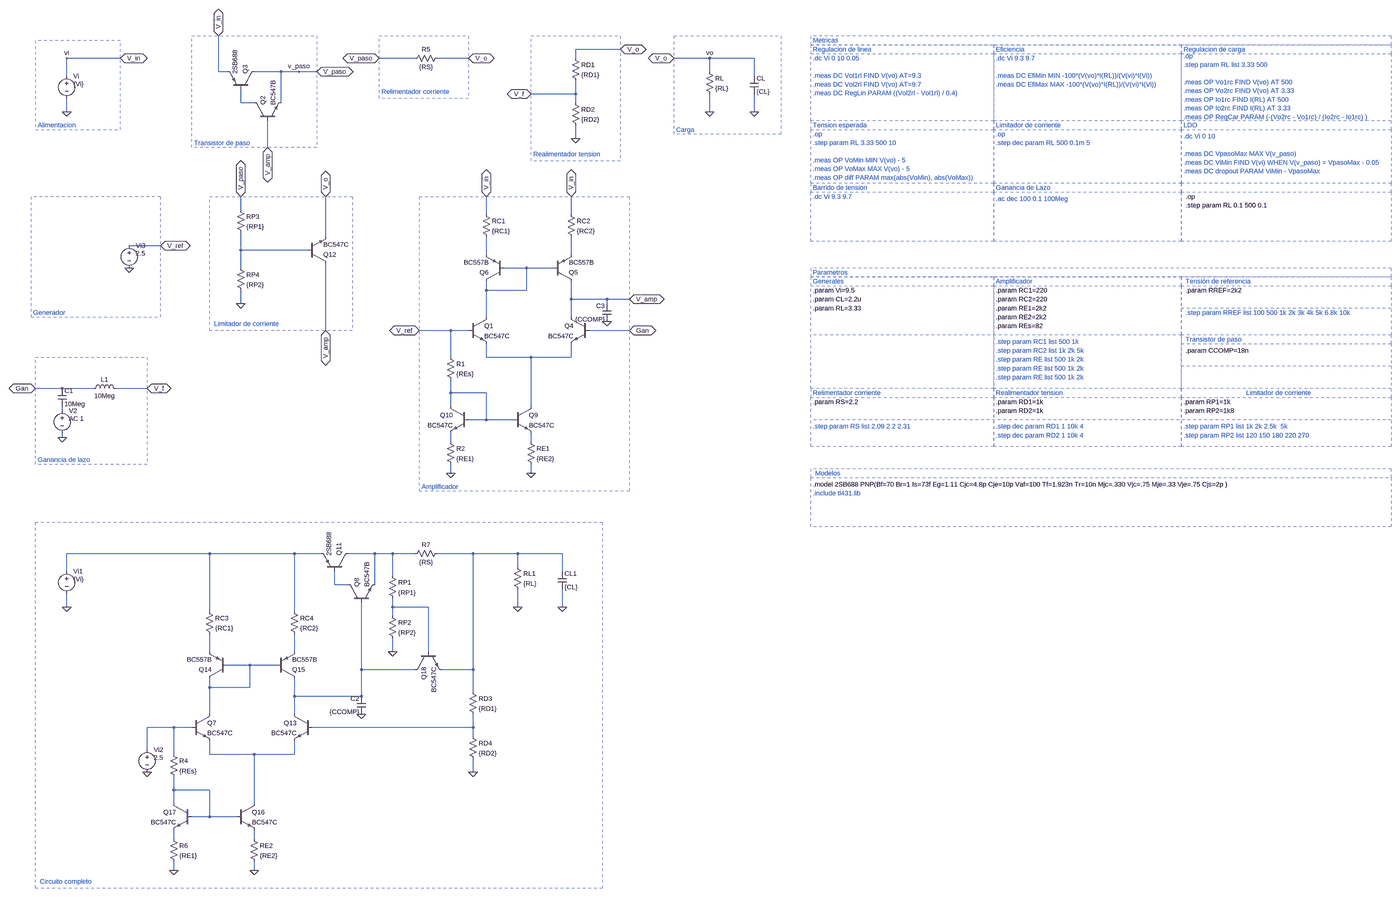
[diagram p0: schematic Etapa lineal.asc, whole sheet]
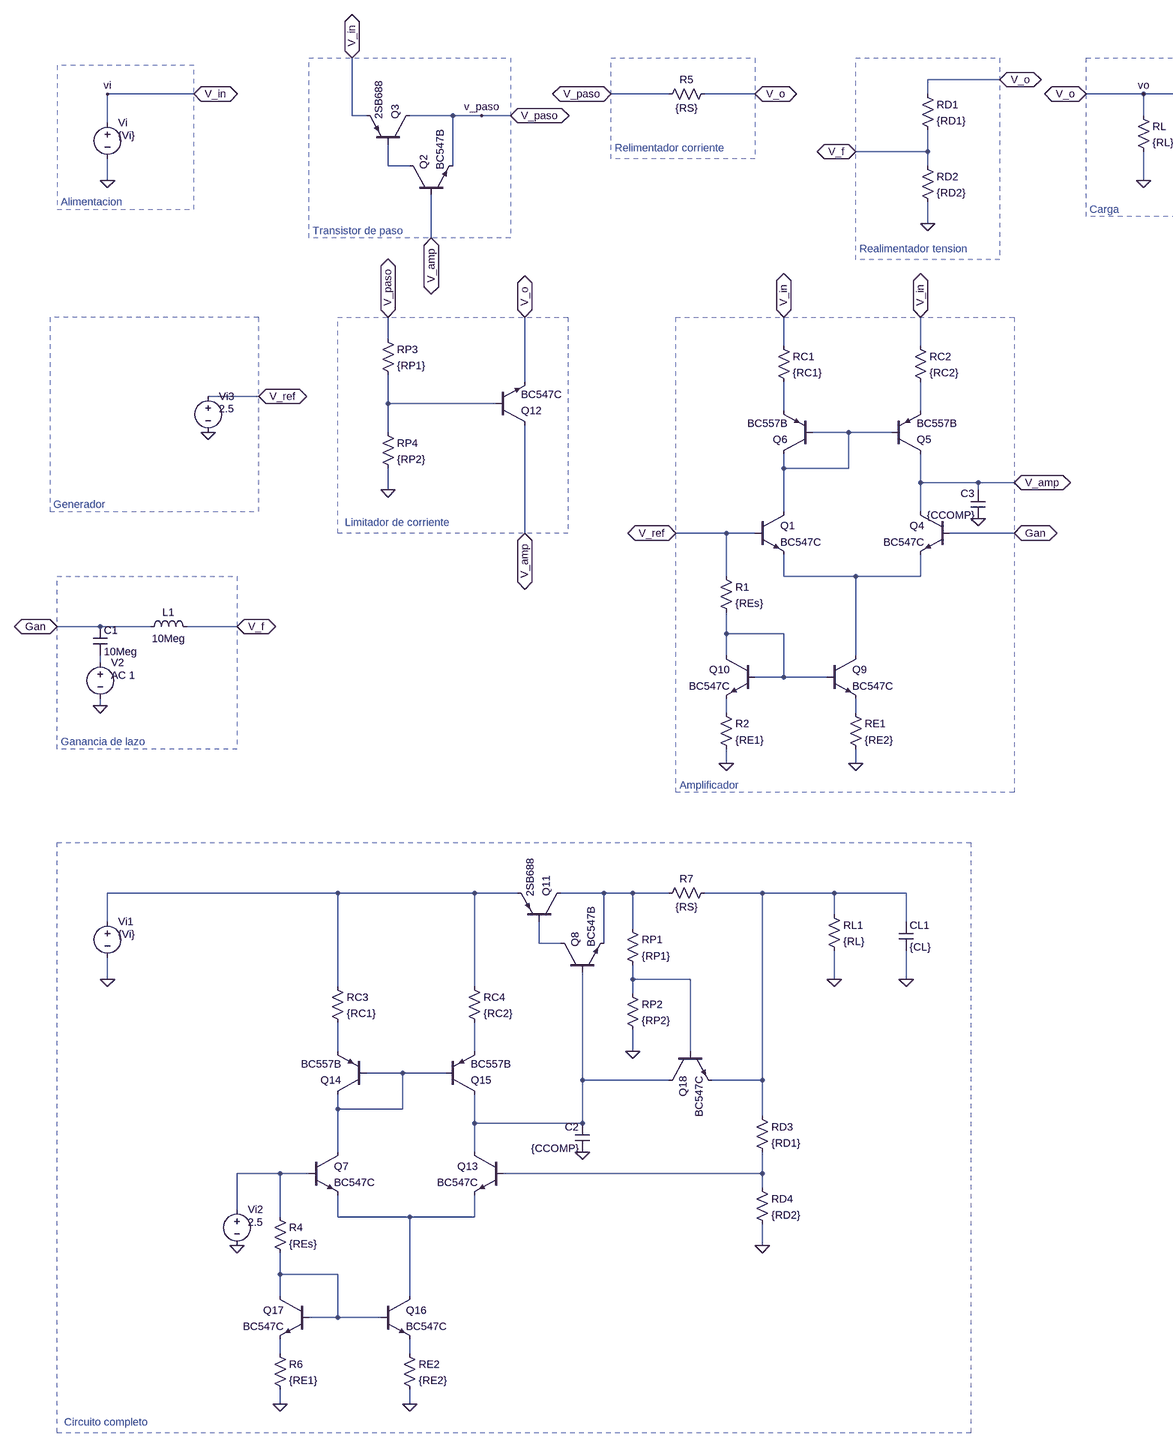
[diagram p1: schematic Etapa lineal.asc, part, row 1 of 1, column 1 of 2]
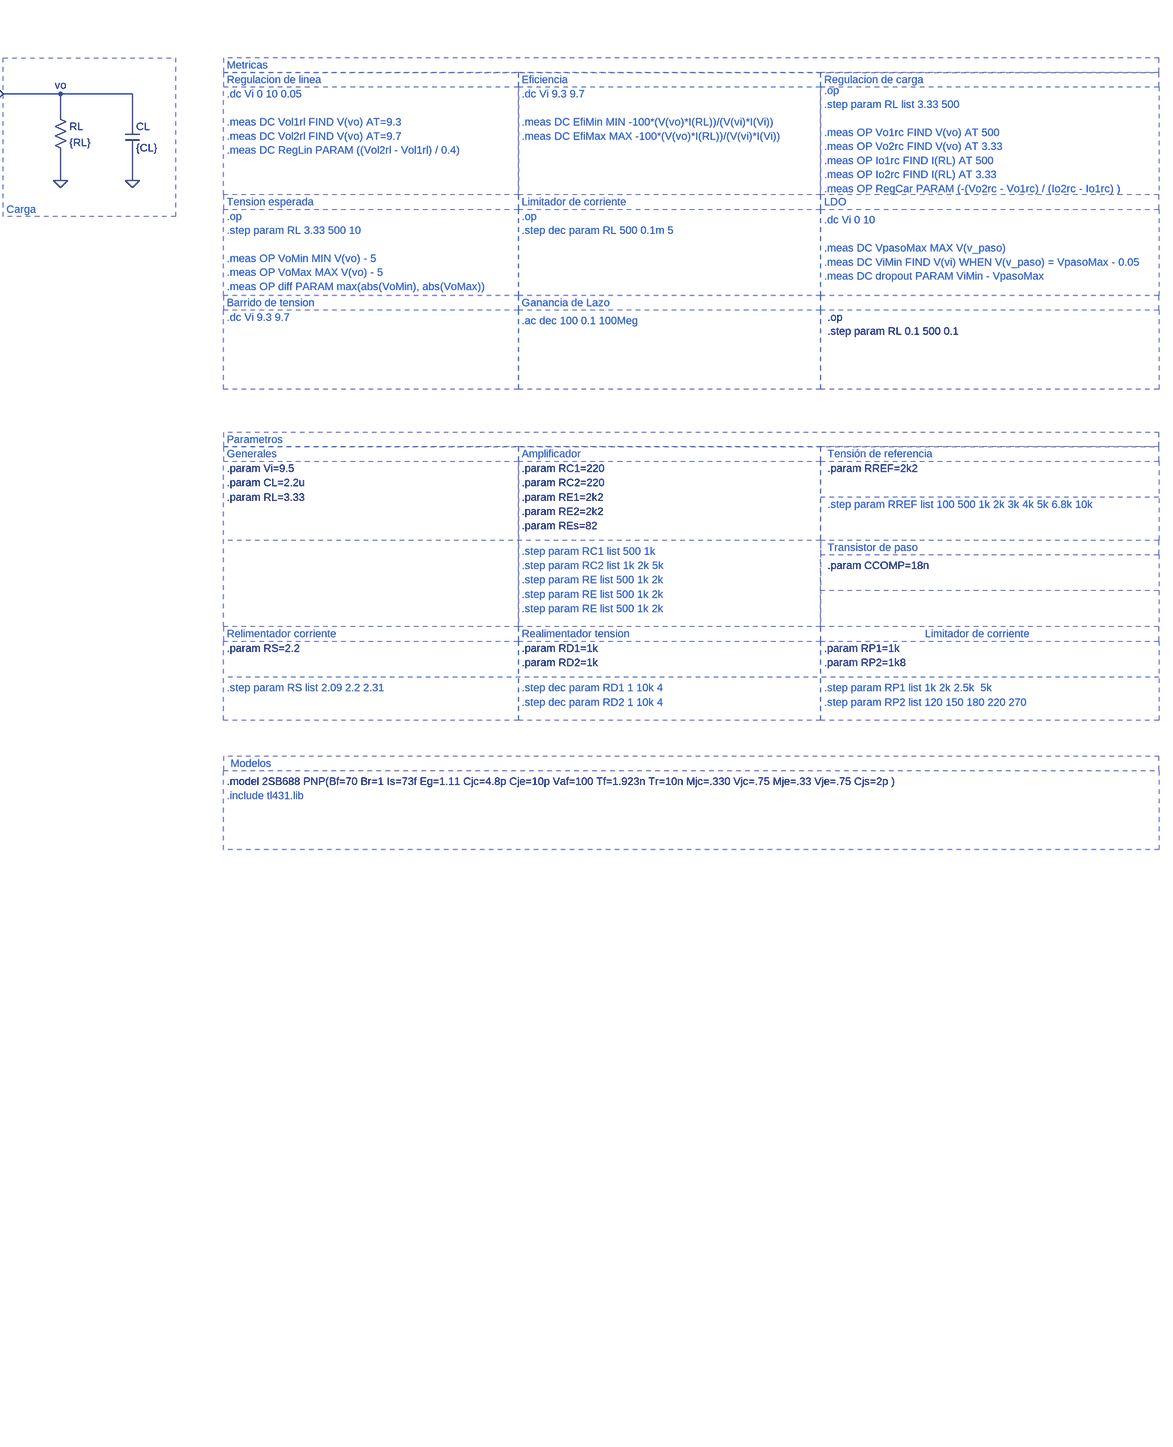
[diagram p2: schematic Etapa lineal.asc, part, row 1 of 1, column 2 of 2]
Etapa lineal.asc, the LTspice schematic file:
Version 4.1
SHEET 1 8164 4196
WIRE 1360 -592 1200 -592
WIRE -432 -560 -624 -560
WIRE 624 -560 496 -560
WIRE 816 -560 704 -560
WIRE 1200 -560 1200 -592
WIRE 1680 -560 1552 -560
WIRE 1840 -560 1680 -560
WIRE -80 -512 -80 -640
WIRE -48 -512 -80 -512
WIRE 144 -512 48 -512
WIRE 208 -512 144 -512
WIRE 272 -512 208 -512
WIRE 1680 -512 1680 -560
WIRE -624 -496 -624 -560
WIRE 1840 -496 1840 -560
WIRE 1200 -432 1200 -480
WIRE 1200 -432 1040 -432
WIRE 0 -400 0 -448
WIRE 48 -400 0 -400
WIRE 144 -400 144 -512
WIRE 1200 -400 1200 -432
WIRE -624 -368 -624 -416
WIRE 1680 -368 1680 -432
WIRE 1840 -368 1840 -432
WIRE 1200 -272 1200 -320
WIRE 96 -240 96 -336
WIRE 0 -16 0 -64
WIRE 880 0 880 -64
WIRE 1184 0 1184 -64
WIRE 304 80 304 -64
WIRE -288 112 -400 112
WIRE 0 128 0 64
WIRE 240 128 0 128
WIRE 880 144 880 80
WIRE 1184 144 1184 80
WIRE 0 192 0 128
WIRE 1024 192 944 192
WIRE 1120 192 1024 192
WIRE 880 272 880 240
WIRE 1024 272 1024 192
WIRE 1024 272 880 272
WIRE 1184 304 1184 240
WIRE 1312 304 1184 304
WIRE 1392 304 1312 304
WIRE 0 320 0 272
WIRE 1312 320 1312 304
WIRE 880 368 880 272
WIRE 1184 368 1184 304
WIRE 304 416 304 176
WIRE 752 416 640 416
WIRE 816 416 752 416
WIRE 1392 416 1248 416
WIRE 752 512 752 416
WIRE 880 512 880 464
WIRE 1040 512 880 512
WIRE 1184 512 1184 464
WIRE 1184 512 1040 512
WIRE -640 624 -736 624
WIRE -528 624 -640 624
WIRE -336 624 -448 624
WIRE 752 640 752 592
WIRE 880 640 752 640
WIRE 752 688 752 640
WIRE 1040 688 1040 512
WIRE -640 704 -640 688
WIRE 880 736 880 640
WIRE 880 736 816 736
WIRE 976 736 880 736
WIRE -640 800 -640 784
WIRE 752 816 752 784
WIRE 1040 816 1040 784
WIRE 752 928 752 896
WIRE 1040 928 1040 896
WIRE -112 1216 -624 1216
WIRE 192 1216 -112 1216
WIRE 288 1216 192 1216
WIRE 480 1216 384 1216
WIRE 544 1216 480 1216
WIRE 624 1216 544 1216
WIRE 832 1216 704 1216
WIRE 992 1216 832 1216
WIRE 1152 1216 992 1216
WIRE 992 1264 992 1216
WIRE -624 1280 -624 1216
WIRE 1152 1280 1152 1216
WIRE 544 1296 544 1216
WIRE 336 1328 336 1280
WIRE 384 1328 336 1328
WIRE 480 1328 480 1216
WIRE -624 1408 -624 1360
WIRE 544 1408 544 1376
WIRE 672 1408 544 1408
WIRE 992 1408 992 1344
WIRE 1152 1408 1152 1344
WIRE -112 1424 -112 1216
WIRE 192 1424 192 1216
WIRE 544 1440 544 1408
WIRE -112 1568 -112 1504
WIRE 192 1568 192 1504
WIRE 544 1568 544 1520
WIRE 672 1568 672 1408
WIRE 32 1616 -48 1616
WIRE 128 1616 32 1616
WIRE 432 1632 432 1392
WIRE 624 1632 432 1632
WIRE 832 1632 832 1216
WIRE 832 1632 720 1632
WIRE -112 1696 -112 1664
WIRE 32 1696 32 1616
WIRE 32 1696 -112 1696
WIRE 832 1712 832 1632
WIRE 192 1728 192 1664
WIRE 432 1728 432 1632
WIRE 432 1728 192 1728
WIRE -112 1792 -112 1696
WIRE 192 1792 192 1728
WIRE -240 1840 -336 1840
WIRE -176 1840 -240 1840
WIRE 832 1840 832 1792
WIRE 832 1840 256 1840
WIRE 832 1872 832 1840
WIRE -336 1920 -336 1840
WIRE -240 1936 -240 1840
WIRE -112 1936 -112 1888
WIRE 48 1936 -112 1936
WIRE 192 1936 192 1888
WIRE 192 1936 48 1936
WIRE 832 2000 832 1952
WIRE -240 2064 -240 2016
WIRE -112 2064 -240 2064
WIRE -240 2112 -240 2064
WIRE 48 2112 48 1936
WIRE -112 2160 -112 2064
WIRE -112 2160 -176 2160
WIRE -16 2160 -112 2160
WIRE -240 2240 -240 2208
WIRE 48 2240 48 2208
WIRE -240 2352 -240 2320
WIRE 48 2352 48 2320
FLAG -288 112 V_ref
IOPIN -288 112 BiDir
FLAG -624 -368 0
FLAG -432 -560 V_in
IOPIN -432 -560 BiDir
FLAG 880 -64 V_in
IOPIN 880 -64 BiDir
FLAG 1200 -272 0
FLAG 640 416 V_ref
IOPIN 640 416 BiDir
FLAG 1680 -368 0
FLAG 1552 -560 V_o
IOPIN 1552 -560 BiDir
FLAG 1680 -560 vo
FLAG 1392 416 Gan
IOPIN 1392 416 BiDir
FLAG 1360 -592 V_o
IOPIN 1360 -592 BiDir
FLAG 1040 -432 V_f
IOPIN 1040 -432 BiDir
FLAG -624 -560 vi
FLAG -80 -640 V_in
IOPIN -80 -640 BiDir
FLAG 1392 304 V_amp
IOPIN 1392 304 BiDir
FLAG 96 -240 V_amp
IOPIN 96 -240 BiDir
FLAG 1040 928 0
FLAG 1184 -64 V_in
IOPIN 1184 -64 BiDir
FLAG 752 928 0
FLAG 816 -560 V_o
IOPIN 816 -560 BiDir
FLAG 1840 -368 0
FLAG 272 -512 V_paso
IOPIN 272 -512 BiDir
FLAG 496 -560 V_paso
IOPIN 496 -560 BiDir
FLAG 0 320 0
FLAG 304 416 V_amp
IOPIN 304 416 BiDir
FLAG 0 -64 V_paso
IOPIN 0 -64 BiDir
FLAG 304 -64 V_o
IOPIN 304 -64 BiDir
FLAG 208 -512 v_paso
FLAG -640 800 0
FLAG -736 624 Gan
IOPIN -736 624 BiDir
FLAG -336 624 V_f
IOPIN -336 624 BiDir
FLAG -624 1408 0
FLAG 832 2000 0
FLAG 992 1408 0
FLAG 48 2352 0
FLAG -240 2352 0
FLAG 1152 1408 0
FLAG 544 1568 0
FLAG -336 2000 0
FLAG -400 192 0
FLAG 1312 384 0
FLAG 432 1792 0
SYMBOL voltage -624 -512 R0
WINDOW 3 24 44 Left 2
WINDOW 123 24 44 Left 2
WINDOW 39 0 0 Left 0
SYMATTR Value {Vi}
SYMATTR InstName Vi
SYMBOL res 864 -16 R0
SYMATTR InstName RC1
SYMATTR Value {RC1}
SYMBOL res 1184 -576 R0
SYMATTR InstName RD1
SYMATTR Value {RD1}
SYMBOL res 1184 -416 R0
SYMATTR InstName RD2
SYMATTR Value {RD2}
SYMBOL res 1664 -528 R0
SYMATTR InstName RL
SYMATTR Value {RL}
SYMBOL npn 816 368 R0
SYMATTR InstName Q1
SYMATTR Value BC547C
SYMBOL npn 48 -336 R270
SYMATTR InstName Q2
SYMATTR Value BC547B
SYMBOL pnp 48 -448 M270
SYMATTR InstName Q3
SYMATTR Value 2SB688
SYMBOL npn 1248 368 M0
SYMATTR InstName Q4
SYMATTR Value BC547C
SYMBOL res 1024 800 R0
SYMATTR InstName RE1
SYMATTR Value {RE2}
SYMBOL res 1168 -16 R0
SYMATTR InstName RC2
SYMATTR Value {RC2}
SYMBOL pnp 944 240 R180
SYMATTR InstName Q6
SYMATTR Value BC557B
SYMBOL pnp 1120 240 M180
SYMATTR InstName Q5
SYMATTR Value BC557B
SYMBOL npn 976 688 R0
SYMATTR InstName Q9
SYMATTR Value BC547C
SYMBOL npn 816 688 M0
SYMATTR InstName Q10
SYMATTR Value BC547C
SYMBOL res 736 496 R0
SYMATTR InstName R1
SYMATTR Value {REs}
SYMBOL res 736 800 R0
SYMATTR InstName R2
SYMATTR Value {RE1}
SYMBOL res 720 -576 R90
WINDOW 0 0 56 VBottom 2
WINDOW 3 32 56 VTop 2
SYMATTR InstName R5
SYMATTR Value {RS}
SYMBOL cap 1824 -496 R0
SYMATTR InstName CL
SYMATTR Value {CL}
SYMBOL res -16 -32 R0
SYMATTR InstName RP3
SYMATTR Value {RP1}
SYMBOL res -16 176 R0
SYMATTR InstName RP4
SYMATTR Value {RP2}
SYMBOL npn 240 176 M180
SYMATTR InstName Q12
SYMATTR Value BC547C
SYMBOL ind -544 640 R270
WINDOW 0 32 56 VTop 2
WINDOW 3 5 56 VBottom 2
SYMATTR InstName L1
SYMATTR Value 10Meg
SYMBOL cap -656 624 R0
SYMATTR InstName C1
SYMATTR Value 10Meg
SYMBOL voltage -640 688 R0
WINDOW 123 24 44 Left 2
WINDOW 39 0 0 Left 0
SYMATTR Value2 AC 1
SYMATTR InstName V2
SYMATTR Value ""
SYMBOL voltage -624 1264 R0
WINDOW 3 24 44 Left 2
WINDOW 123 24 44 Left 2
WINDOW 39 0 0 Left 0
SYMATTR Value {Vi}
SYMATTR InstName Vi1
SYMBOL res -128 1408 R0
SYMATTR InstName RC3
SYMATTR Value {RC1}
SYMBOL res 816 1696 R0
SYMATTR InstName RD3
SYMATTR Value {RD1}
SYMBOL res 816 1856 R0
SYMATTR InstName RD4
SYMATTR Value {RD2}
SYMBOL res 976 1248 R0
SYMATTR InstName RL1
SYMATTR Value {RL}
SYMBOL npn -176 1792 R0
SYMATTR InstName Q7
SYMATTR Value BC547C
SYMBOL npn 384 1392 R270
SYMATTR InstName Q8
SYMATTR Value BC547B
SYMBOL pnp 384 1280 M270
SYMATTR InstName Q11
SYMATTR Value 2SB688
SYMBOL npn 256 1792 M0
SYMATTR InstName Q13
SYMATTR Value BC547C
SYMBOL res 32 2224 R0
SYMATTR InstName RE2
SYMATTR Value {RE2}
SYMBOL res 176 1408 R0
SYMATTR InstName RC4
SYMATTR Value {RC2}
SYMBOL pnp -48 1664 R180
SYMATTR InstName Q14
SYMATTR Value BC557B
SYMBOL pnp 128 1664 M180
SYMATTR InstName Q15
SYMATTR Value BC557B
SYMBOL npn -16 2112 R0
SYMATTR InstName Q16
SYMATTR Value BC547C
SYMBOL npn -176 2112 M0
SYMATTR InstName Q17
SYMATTR Value BC547C
SYMBOL res -256 1920 R0
SYMATTR InstName R4
SYMATTR Value {REs}
SYMBOL res -256 2224 R0
SYMATTR InstName R6
SYMATTR Value {RE1}
SYMBOL res 720 1200 R90
WINDOW 0 0 56 VBottom 2
WINDOW 3 32 56 VTop 2
SYMATTR InstName R7
SYMATTR Value {RS}
SYMBOL cap 1136 1280 R0
SYMATTR InstName CL1
SYMATTR Value {CL}
SYMBOL res 528 1280 R0
SYMATTR InstName RP1
SYMATTR Value {RP1}
SYMBOL res 528 1424 R0
SYMATTR InstName RP2
SYMATTR Value {RP2}
SYMBOL npn 624 1568 M90
SYMATTR InstName Q18
SYMATTR Value BC547C
SYMBOL cap 1328 320 M0
SYMATTR InstName C3
SYMATTR Value {CCOMP}
SYMBOL cap 448 1728 M0
SYMATTR InstName C2
SYMATTR Value {CCOMP}
SYMBOL voltage -336 1904 R0
WINDOW 3 24 44 Left 2
WINDOW 123 24 44 Left 2
WINDOW 39 0 0 Left 0
SYMATTR Value 2.5
SYMATTR InstName Vi2
SYMBOL voltage -400 96 R0
WINDOW 3 24 44 Left 2
WINDOW 123 24 44 Left 2
WINDOW 39 0 0 Left 0
SYMATTR Value 2.5
SYMATTR InstName Vi3
TEXT 2856 456 Left 2 ;.step param RC1 list 500 1k
TEXT 3528 -592 Left 2 ;Regulacion de carga
TEXT -168 -256 Left 2 ;Transistor de paso
TEXT 1048 -216 Left 2 ;Realimentador tension
TEXT 1560 -304 Left 2 ;Carga
TEXT 648 976 Left 2 ;Amplificador
TEXT -728 -320 Left 2 ;Alimentacion
TEXT -744 352 Left 2 ;Generador
TEXT 2856 -592 Left 2 ;Eficiencia
TEXT 2200 -592 Left 2 ;Regulacion de linea
TEXT 2200 -560 Left 2 ;.dc Vi 0 10 0.05\n \n.meas DC Vol1rl FIND V(vo) AT=9.3\n.meas DC Vol2rl FIND V(vo) AT=9.7\n.meas DC RegLin PARAM ((Vol2rl - Vol1rl) / 0.4)
TEXT 3528 -568 Left 2 ;.op\n.step param RL list 3.33 500\n \n.meas OP Vo1rc FIND V(vo) AT 500\n.meas OP Vo2rc FIND V(vo) AT 3.33\n.meas OP Io1rc FIND I(RL) AT 500\n.meas OP Io2rc FIND I(RL) AT 3.33\n.meas OP RegCar PARAM (-(Vo2rc - Vo1rc) / (Io2rc - Io1rc) )
TEXT 2856 304 Left 2 !.param RC2=220
TEXT 2200 240 Left 2 ;Generales
TEXT 2856 240 Left 2 ;Amplificador
TEXT 2856 -560 Left 2 ;.dc Vi 9.3 9.7\n \n.meas DC EfiMin MIN -100*(V(vo)*I(RL))/(V(vi)*I(Vi))\n.meas DC EfiMax MAX -100*(V(vo)*I(RL))/(V(vi)*I(Vi))
TEXT 2200 272 Left 2 !.param Vi=9.5
TEXT 2856 520 Left 2 ;.step param RE list 500 1k 2k
TEXT 2856 336 Left 2 !.param RE1=2k2
TEXT 2200 968 Left 2 !.model 2SB688 PNP(Bf=70 Br=1 Is=73f Eg=1.11 Cjc=4.8p Cje=10p Vaf=100 Tf=1.923n Tr=10n Mjc=.330 Vjc=.75 Mje=.33 Vje=.75 Cjs=2p )
TEXT 2856 -288 Left 2 ;.op\n.step dec param RL 500 0.1m 5
TEXT 2856 -320 Left 2 ;Limitador de corriente
TEXT 2208 928 Left 2 ;Modelos
TEXT 2856 488 Left 2 ;.step param RC2 list 1k 2k 5k
TEXT 2200 -320 Left 2 ;Tension esperada
TEXT 2200 -288 Left 2 ;.op\n.step param RL 3.33 500 10\n \n.meas OP VoMin MIN V(vo) - 5\n.meas OP VoMax MAX V(vo) - 5\n.meas OP diff PARAM max(abs(VoMin), abs(VoMax))
TEXT 2200 304 Left 2 !.param CL=2.2u
TEXT 2856 672 Left 2 !.param RD1=1k
TEXT 2856 760 Left 2 ;.step dec param RD1 1 10k 4
TEXT 2200 672 Left 2 !.param RS=2.2
TEXT 504 -440 Left 2 ;Relimentador corriente
TEXT 2200 760 Left 2 ;.step param RS list 2.09 2.2 2.31
TEXT -96 392 Left 2 ;Limitador de corriente
TEXT 3528 -320 Left 2 ;LDO
TEXT 3528 -280 Left 2 ;.dc Vi 0 10\n \n.meas DC VpasoMax MAX V(v_paso)\n.meas DC ViMin FIND V(vi) WHEN V(v_paso) = VpasoMax - 0.05\n.meas DC dropout PARAM ViMin - VpasoMax
TEXT 2200 336 Left 2 !.param RL=3.33
TEXT 2200 640 Left 2 ;Relimentador corriente
TEXT 2200 208 Left 2 ;Parametros
TEXT 2200 -624 Left 2 ;Metricas
TEXT 2856 640 Left 2 ;Realimentador tension
TEXT 2856 792 Left 2 ;.step dec param RD2 1 10k 4
TEXT 2200 -96 Left 2 ;Barrido de tension
TEXT 2200 -64 Left 2 ;.dc Vi 9.3 9.7
TEXT 3528 672 Left 2 !.param RP1=1k
TEXT 3528 760 Left 2 ;.step param RP1 list 1k 2k 2.5k  5k
TEXT 3752 640 Left 2 ;Limitador de corriente
TEXT 3528 704 Left 2 !.param RP2=1k8
TEXT 3528 792 Left 2 ;.step param RP2 list 120 150 180 220 270
TEXT 2200 1000 Left 2 ;.include tl431.lib
TEXT 3536 240 Left 2 ;Tensión de referencia
TEXT 3536 272 Left 2 !.param RREF=2k2
TEXT 3536 352 Left 2 ;.step param RREF list 100 500 1k 2k 3k 4k 5k 6.8k 10k
TEXT 2856 400 Left 2 !.param REs=82
TEXT 2856 -56 Left 2 ;.ac dec 100 0.1 100Meg
TEXT -728 880 Left 2 ;Ganancia de lazo
TEXT 2856 -96 Left 2 ;Ganancia de Lazo
TEXT 2856 272 Left 2 !.param RC1=220
TEXT 2856 368 Left 2 !.param RE2=2k2
TEXT 2856 552 Left 2 ;.step param RE list 500 1k 2k
TEXT 2856 584 Left 2 ;.step param RE list 500 1k 2k
TEXT 2856 704 Left 2 !.param RD2=1k
TEXT 3536 448 Left 2 ;Transistor de paso
TEXT 3536 488 Left 2 !.param CCOMP=18n
TEXT -720 2392 Left 2 ;Circuito completo
TEXT 3536 -64 Left 2 !.op\n.step param RL 0.1 500 0.1
LINE Normal 3520 432 2192 432 2
LINE Normal 4272 736 2192 736 2
LINE Normal 4272 336 3520 336 2
LINE Normal 4272 544 3520 544 2
RECTANGLE Normal 272 -240 -176 -640 2
RECTANGLE Normal 1360 -192 1040 -640 2
RECTANGLE Normal 1936 -288 1552 -640 2
RECTANGLE Normal 1392 992 640 -64 2
RECTANGLE Normal -736 -304 -432 -624 2
RECTANGLE Normal -752 368 -288 -64 2
RECTANGLE Normal 816 -416 496 -640 2
RECTANGLE Normal 400 416 -112 -64 2
RECTANGLE Normal 2848 -336 2192 -576 2
RECTANGLE Normal 3520 -336 2848 -576 2
RECTANGLE Normal 4272 -336 3520 -576 2
RECTANGLE Normal 2848 -608 2192 -576 2
RECTANGLE Normal 3520 -608 2848 -576 2
RECTANGLE Normal 4272 -608 3520 -576 2
RECTANGLE Normal 2848 -336 2192 -304 2
RECTANGLE Normal 3520 -336 2848 -304 2
RECTANGLE Normal 4272 -336 3520 -304 2
RECTANGLE Normal 2848 -112 2192 -304 2
RECTANGLE Normal 4272 -112 3520 -304 2
RECTANGLE Normal 2848 224 2192 256 2
RECTANGLE Normal 2848 624 2192 256 2
RECTANGLE Normal 3520 624 2848 256 2
RECTANGLE Normal 3520 224 2848 256 2
RECTANGLE Normal 3520 -112 2848 -304 2
RECTANGLE Normal 4272 224 3520 256 2
RECTANGLE Normal 4272 432 3520 256 2
RECTANGLE Normal 2848 624 2192 656 2
RECTANGLE Normal 3520 624 2848 656 2
RECTANGLE Normal 4272 624 3520 656 2
RECTANGLE Normal 2848 832 2192 656 2
RECTANGLE Normal 4272 192 2192 224 2
RECTANGLE Normal 4272 -640 2192 -608 2
RECTANGLE Normal 3520 832 2848 656 2
RECTANGLE Normal 2848 -80 3520 -112 2
RECTANGLE Normal 3520 96 2848 -80 2
RECTANGLE Normal 2848 -112 2192 -80 2
RECTANGLE Normal 2848 96 2192 -80 2
RECTANGLE Normal 4272 832 3520 656 2
RECTANGLE Normal 4272 912 2192 944 2
RECTANGLE Normal 4272 1120 2192 944 2
RECTANGLE Normal -336 896 -736 512 2
RECTANGLE Normal 3520 -80 4272 -112 2
RECTANGLE Normal 4272 96 3520 -80 2
RECTANGLE Normal 4272 432 3520 464 2
RECTANGLE Normal 4272 624 3520 464 2
RECTANGLE Normal 1296 2416 -736 1104 2

The netlist it stands for:
* Etapa lineal.asc
Vi vi 0 {Vi}
RC1 vi N003 {RC1}
RD1 vo V_f {RD1}
RD2 V_f 0 {RD2}
RL vo 0 {RL}
Q1 N005 V_ref N006 0 BC547C
Q2 N001 V_amp V_paso 0 BC547B
Q3 V_paso N001 vi 0 2SB688
Q4 V_amp Gan N006 0 BC547C
RE1 N010 0 {RE2}
RC2 vi N004 {RC2}
Q6 N005 N005 N003 0 BC557B
Q5 V_amp N005 N004 0 BC557B
Q9 N006 N007 N010 0 BC547C
Q10 N007 N007 N009 0 BC547C
R1 V_ref N007 {REs}
R2 N009 0 {RE1}
R5 vo V_paso {RS}
CL vo 0 {CL}
RP3 V_paso N002 {RP1}
RP4 N002 0 {RP2}
Q12 V_amp N002 vo 0 BC547C
L1 Gan V_f 10Meg
C1 Gan N008 10Meg
V2 N008 0 AC 1
Vi1 N011 0 {Vi}
RC3 N011 N016 {RC1}
RD3 N013 N021 {RD1}
RD4 N021 0 {RD2}
RL1 N013 0 {RL}
Q7 N018 N020 N022 0 BC547C
Q8 N014 N019 N012 0 BC547B
Q11 N012 N014 N011 0 2SB688
Q13 N019 N021 N022 0 BC547C
RE2 N025 0 {RE2}
RC4 N011 N017 {RC2}
Q14 N018 N018 N016 0 BC557B
Q15 N019 N018 N017 0 BC557B
Q16 N022 N023 N025 0 BC547C
Q17 N023 N023 N024 0 BC547C
R4 N020 N023 {REs}
R6 N024 0 {RE1}
R7 N013 N012 {RS}
CL1 N013 0 {CL}
RP1 N012 N015 {RP1}
RP2 N015 0 {RP2}
Q18 N019 N015 N013 0 BC547C
C3 V_amp 0 {CCOMP}
C2 N019 0 {CCOMP}
Vi2 N020 0 2.5
Vi3 V_ref 0 2.5
.model NPN NPN
.model PNP PNP
.lib standard.bjt
* .step param RC1 list 500 1k
* Regulacion de carga
* Transistor de paso
* Realimentador tension
* Carga
* Amplificador
* Alimentacion
* Generador
* Eficiencia
* Regulacion de linea
* .dc Vi 0 10 0.05
* .meas DC Vol1rl FIND V(vo) AT=9.3
* .meas DC Vol2rl FIND V(vo) AT=9.7
* .meas DC RegLin PARAM ((Vol2rl - Vol1rl) / 0.4)
* .op
* .step param RL list 3.33 500
* .meas OP Vo1rc FIND V(vo) AT 500
* .meas OP Vo2rc FIND V(vo) AT 3.33
* .meas OP Io1rc FIND I(RL) AT 500
* .meas OP Io2rc FIND I(RL) AT 3.33
* .meas OP RegCar PARAM (-(Vo2rc - Vo1rc) / (Io2rc - Io1rc) )
.param RC2=220
* Generales
* Amplificador
* .dc Vi 9.3 9.7
* .meas DC EfiMin MIN -100*(V(vo)*I(RL))/(V(vi)*I(Vi))
* .meas DC EfiMax MAX -100*(V(vo)*I(RL))/(V(vi)*I(Vi))
.param Vi=9.5
* .step param RE list 500 1k 2k
.param RE1=2k2
.model 2SB688 PNP(Bf=70 Br=1 Is=73f Eg=1.11 Cjc=4.8p Cje=10p Vaf=100 Tf=1.923n Tr=10n Mjc=.330 Vjc=.75 Mje=.33 Vje=.75 Cjs=2p )
* .op
* .step dec param RL 500 0.1m 5
* Limitador de corriente
* Modelos
* .step param RC2 list 1k 2k 5k
* Tension esperada
* .op
* .step param RL 3.33 500 10
* .meas OP VoMin MIN V(vo) - 5
* .meas OP VoMax MAX V(vo) - 5
* .meas OP diff PARAM max(abs(VoMin), abs(VoMax))
.param CL=2.2u
.param RD1=1k
* .step dec param RD1 1 10k 4
.param RS=2.2
* Relimentador corriente
* .step param RS list 2.09 2.2 2.31
* Limitador de corriente
* LDO
* .dc Vi 0 10
* .meas DC VpasoMax MAX V(v_paso)
* .meas DC ViMin FIND V(vi) WHEN V(v_paso) = VpasoMax - 0.05
* .meas DC dropout PARAM ViMin - VpasoMax
.param RL=3.33
* Relimentador corriente
* Parametros
* Metricas
* Realimentador tension
* .step dec param RD2 1 10k 4
* Barrido de tension
* .dc Vi 9.3 9.7
.param RP1=1k
* .step param RP1 list 1k 2k 2.5k  5k
* Limitador de corriente
.param RP2=1k8
* .step param RP2 list 120 150 180 220 270
* .include tl431.lib
* Tensión de referencia
.param RREF=2k2
* .step param RREF list 100 500 1k 2k 3k 4k 5k 6.8k 10k
.param REs=82
* .ac dec 100 0.1 100Meg
* Ganancia de lazo
* Ganancia de Lazo
.param RC1=220
.param RE2=2k2
* .step param RE list 500 1k 2k
* .step param RE list 500 1k 2k
.param RD2=1k
* Transistor de paso
.param CCOMP=18n
* Circuito completo
.op
.step param RL 0.1 500 0.1
.backanno
.end